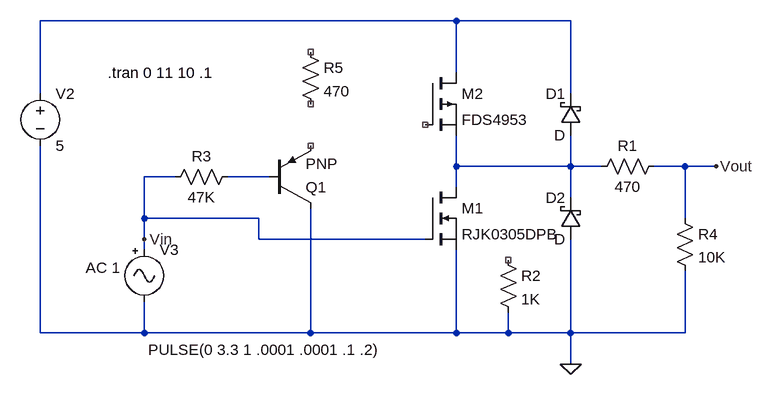
[diagram p0: schematic spank_dig_output_2fet.asc]
spank_dig_output_2fet.asc, the LTspice schematic file:
Version 4
SHEET 1 896 784
WIRE 176 144 -464 144
WIRE 352 144 176 144
WIRE 176 224 176 144
WIRE -464 256 -464 144
WIRE 352 256 352 144
WIRE 176 368 176 320
WIRE 352 368 352 320
WIRE 352 368 176 368
WIRE 400 368 352 368
WIRE 528 368 480 368
WIRE 576 368 528 368
WIRE -256 384 -304 384
WIRE -112 384 -176 384
WIRE 176 400 176 368
WIRE 352 416 352 368
WIRE -304 448 -304 384
WIRE -128 448 -304 448
WIRE 528 448 528 368
WIRE -304 480 -304 448
WIRE -128 480 -128 448
WIRE 128 480 -128 480
WIRE -304 496 -304 480
WIRE -464 624 -464 336
WIRE -304 624 -304 576
WIRE -304 624 -464 624
WIRE -48 624 -48 432
WIRE -48 624 -304 624
WIRE 176 624 176 496
WIRE 176 624 -48 624
WIRE 256 624 256 592
WIRE 256 624 176 624
WIRE 352 624 352 480
WIRE 352 624 256 624
WIRE 528 624 528 528
WIRE 528 624 352 624
WIRE 352 672 352 624
FLAG 352 672 0
FLAG -304 480 Vin
FLAG 576 368 Vout
SYMBOL res 496 352 R90
WINDOW 0 0 56 VBottom 2
WINDOW 3 32 56 VTop 2
SYMATTR InstName R1
SYMATTR Value 470
SYMBOL Misc\\signal -304 480 R0
WINDOW 123 -90 44 Left 2
WINDOW 39 0 0 Left 0
WINDOW 3 6 170 Left 2
SYMATTR Value2 AC 1
SYMATTR Value PULSE(0 3.3 1 .0001 .0001 .1 .2)
SYMATTR InstName V3
SYMBOL voltage -464 240 R0
WINDOW 123 0 0 Left 0
WINDOW 39 0 0 Left 0
SYMATTR InstName V2
SYMATTR Value 5
SYMBOL schottky 368 320 R180
WINDOW 0 24 64 Left 2
WINDOW 3 24 0 Left 2
SYMATTR InstName D1
SYMBOL schottky 368 480 R180
WINDOW 0 24 64 Left 2
WINDOW 3 24 0 Left 2
SYMATTR InstName D2
SYMBOL nmos 128 400 R0
SYMATTR InstName M1
SYMATTR Value RJK0305DPB
SYMBOL res -160 368 R90
WINDOW 0 0 56 VBottom 2
WINDOW 3 32 56 VTop 2
SYMATTR InstName R3
SYMATTR Value 47K
SYMBOL res 512 432 R0
SYMATTR InstName R4
SYMATTR Value 10K
SYMBOL pmos 128 224 R0
SYMATTR InstName M2
SYMATTR Value FDS4953
SYMBOL res 240 496 R0
SYMATTR InstName R2
SYMATTR Value 1K
SYMBOL res -64 176 R0
SYMATTR InstName R5
SYMATTR Value 470
SYMBOL pnp -112 432 M180
SYMATTR InstName Q1
TEXT -360 224 Left 2 !.tran 0 11 10 .1

The netlist it stands for:
* spank_dig_output_2fet.asc
R1 Vout N002 470
V3 Vin 0 PULSE(0 3.3 1 .0001 .0001 .1 .2) AC 1
V2 N001 0 5
D1 N002 N001 D
D2 0 N002 D
M1 N002 Vin 0 0 RJK0305DPB
R3 N003 Vin 47K
R4 Vout 0 10K
M2 N001 NC_01 N002 N002 FDS4953
R2 NC_02 0 1K
R5 NC_03 NC_04 470
Q1 0 N003 NC_05 0 PNP
.model D D
.lib standard.dio
.model NPN NPN
.model PNP PNP
.lib standard.bjt
.model NMOS NMOS
.model PMOS PMOS
.lib standard.mos
.tran 0 11 10 .1
.backanno
.end